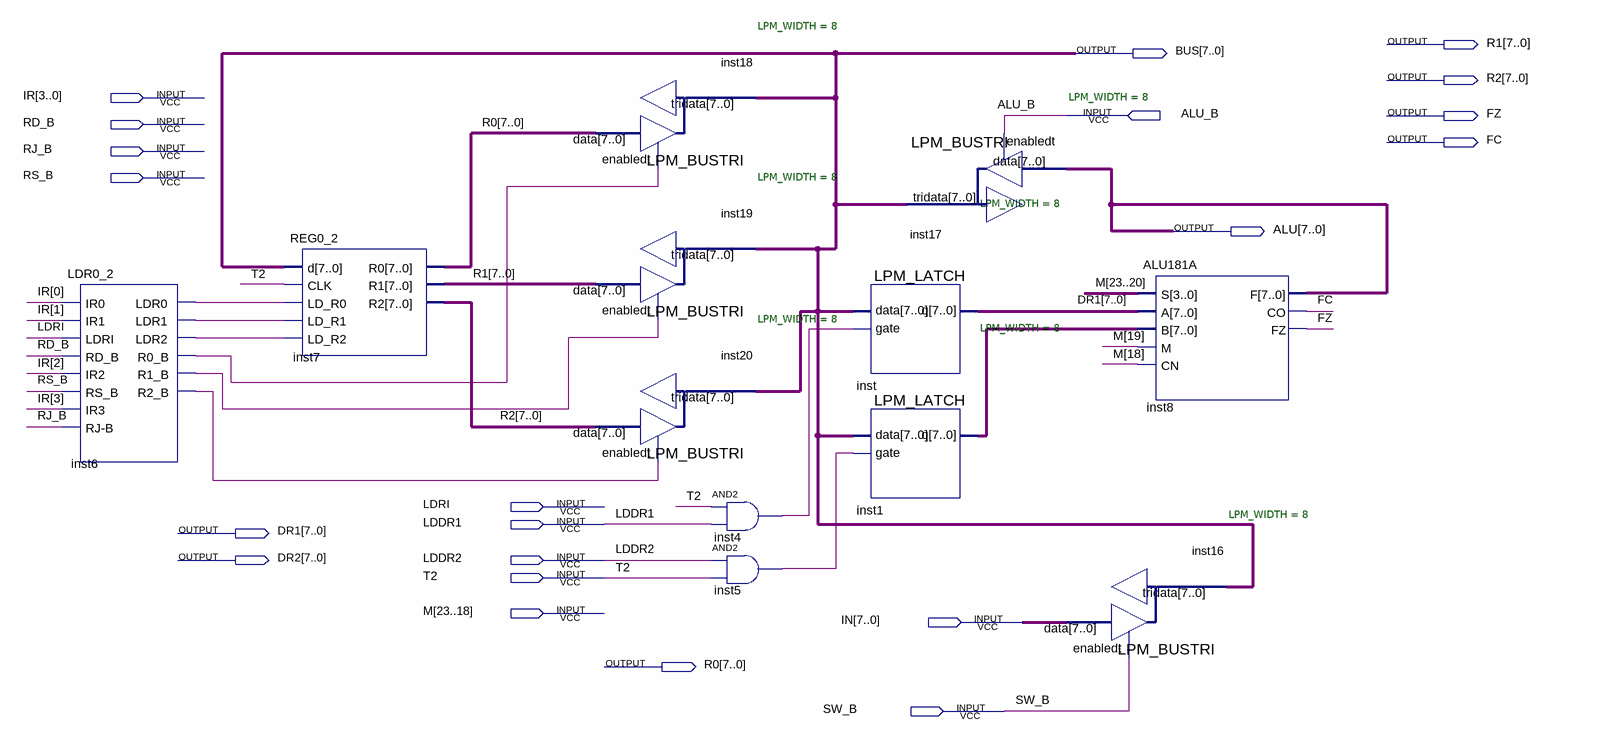
[diagram p0: schematic sheet]
// Quartus schematic ALU_MD.bdf as structural Verilog: 12 symbols, 21 pins
module ALU_MD (
  input  [3:0] IR,
  input  ALU_B,
  input  RD_B,
  input  RJ_B,
  input  RS_B,
  input  LDRI,
  input  LDDR1,
  input  LDDR2,
  input  T2,
  input  [23:18] M,
  input  [7:0] IN,
  input  SW_B,
  output [7:0] R1,
  output [7:0] BUS,
  output [7:0] R2,
  output FZ,
  output FC,
  output [7:0] ALU,
  output [7:0] DR1,
  output [7:0] DR2,
  output [7:0] R0
);

  wire inst4_out, inst5_out, inst6_ldr0, inst6_ldr1, inst6_ldr2, inst6_r0_b, inst6_r1_b, inst6_r2_b;
  wire [7:0] inst1_q;

  LDR0_2 inst6 (
    .IR0(IR[0]), .IR1(IR[1]), .LDRI(LDRI), .RD_B(RD_B), .IR2(IR[2]), .RS_B(RS_B), .IR3(IR[3]), .\RJ-B (RJ_B),
    .LDR0(inst6_ldr0), .LDR1(inst6_ldr1), .LDR2(inst6_ldr2), .R0_B(inst6_r0_b), .R1_B(inst6_r1_b),
    .R2_B(inst6_r2_b));
  REG0_2 inst7 (
    .d(BUS), .CLK(T2), .LD_R0(inst6_ldr0), .LD_R1(inst6_ldr1), .LD_R2(inst6_ldr2), .R0(R0), .R1(R1), .R2(R2));
  LPM_BUSTRI #(.LPM_WIDTH(8)) inst18 (.data(R0), .enabledt(inst6_r0_b), .tridata(BUS));
  LPM_BUSTRI #(.LPM_WIDTH(8)) inst19 (.data(R1), .enabledt(inst6_r1_b), .tridata(BUS));
  LPM_BUSTRI #(.LPM_WIDTH(8)) inst20 (.data(R2), .enabledt(inst6_r2_b), .tridata(BUS));
  and inst4 (inst4_out, T2, LDDR1);
  and inst5 (inst5_out, LDDR2, T2);
  LPM_BUSTRI #(.LPM_WIDTH(8)) inst17 (.data(ALU), .enabledt(ALU_B), .tridata(BUS));
  LPM_LATCH #(.LPM_WIDTH(8)) inst (.data(BUS), .gate(inst4_out), .q(DR1));
  LPM_LATCH #(.LPM_WIDTH(8)) inst1 (.data(BUS), .gate(inst5_out), .q(inst1_q));
  LPM_BUSTRI #(.LPM_WIDTH(8)) inst16 (.data(IN), .enabledt(SW_B), .tridata(BUS));
  ALU181A inst8 (.S(M[23:20]), .A(DR1), .B(inst1_q), .M(M[19]), .CN(M[18]), .F(ALU), .CO(FC), .FZ(FZ));
endmodule
